# EAGLE design SevenSegmentDriver (EAGLE 7.5.0)
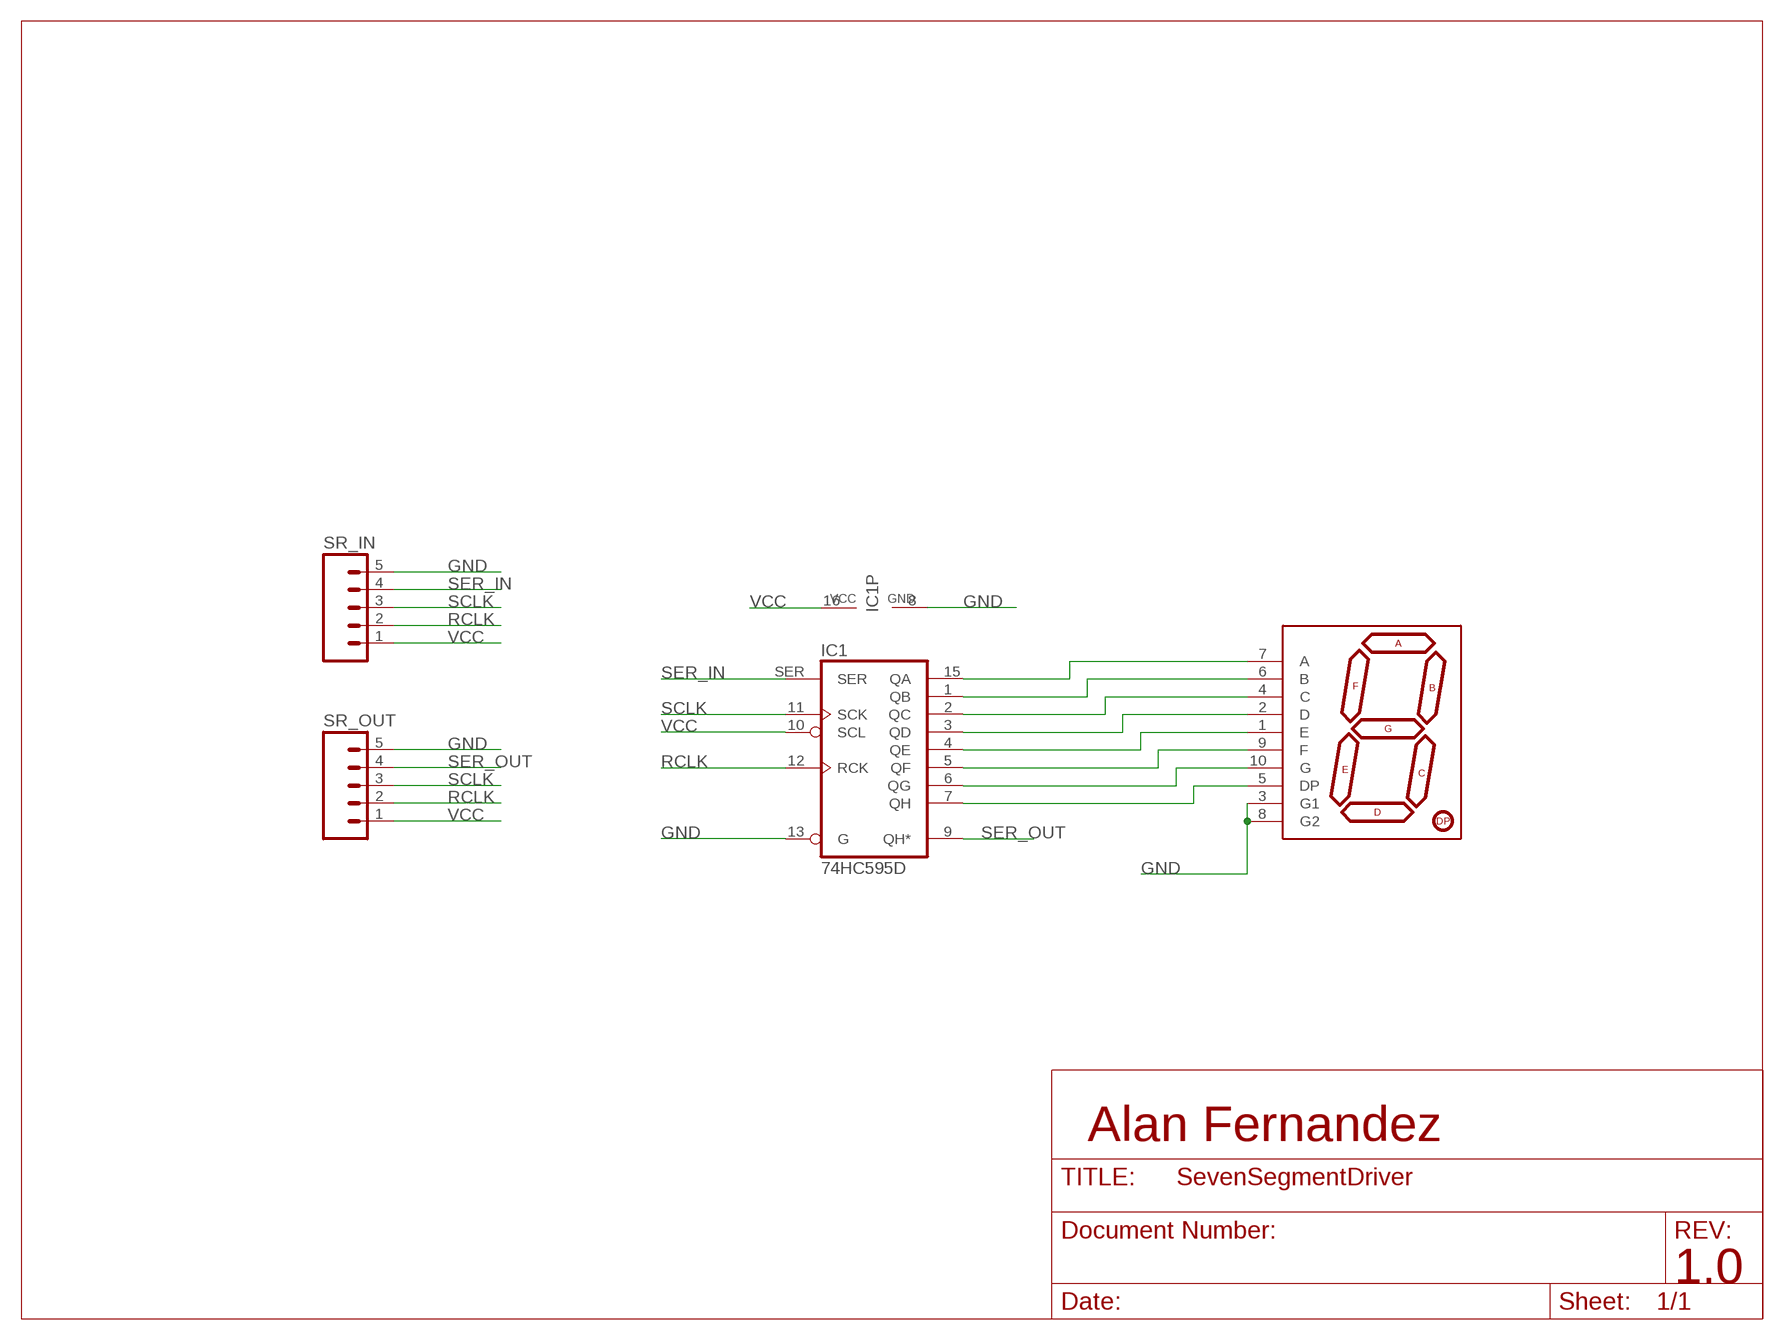
[diagram p0: schematic, sheet 1]

## Parts
IC1  74HC595D  [SO16]
SR_IN  M05PTH  [1X05]
SR_OUT  M05PTH  [1X05]
U$1  7-SEGMENT-DISPLAY-1"-REDEZ  [7-SEGMENT-1"PTH-EZ]

## Nets
GND: IC1.8(GND) IC1.13(G) SR_IN.5 SR_OUT.5 U$1.3(G1) U$1.8(G2)
N$3: IC1.15(QA) U$1.7(A)
N$4: IC1.1(QB) U$1.6(B)
N$5: IC1.2(QC) U$1.4(C)
N$6: IC1.3(QD) U$1.2(D)
N$7: IC1.4(QE) U$1.1(E)
N$8: IC1.5(QF) U$1.9(F)
N$9: IC1.6(QG) U$1.10(G)
N$10: IC1.7(QH) U$1.5(DP)
RCLK: IC1.12(RCK) SR_IN.2 SR_OUT.2
SCLK: IC1.11(SCK) SR_IN.3 SR_OUT.3
SER_IN: IC1.SER SR_IN.4
SER_OUT: IC1.9(QH*) SR_OUT.4
VCC: IC1.10(SCL) IC1.16(VCC) SR_IN.1 SR_OUT.1

## Notes on the sheet
- Alan Fernandez
- 1.0

## Library data of the parts
IC1 = 74xx-eu:74*595: 8-bit SHIFT REGISTER, output latch
SR_IN SR_OUT = SparkFun-Connectors:M05: Header 5 Standard 5-pin 0.1" header. Use with straight break away headers (SKU : PRT-00116), right angle break away headers (PRT-00553), swiss pins (PRT-00743), machine pins (PRT-00117), and female headers (PRT-00115). Molex polarized connector foot print use with SKU : PRT-08230 with associated crimp pins and housings.
U$1 = SparkFun-Displays:7-SEGMENT-DISPLAY-1"-RED: 7-Segment Display 1" Red (COM-08546) EZ is for kits. Pads are only exposed on the bottom side to help prevent soldering in upside down.

## Net classes
0 default: width 0.406 mm, drill 0.381 mm, clearance 0.305 mm

## Board
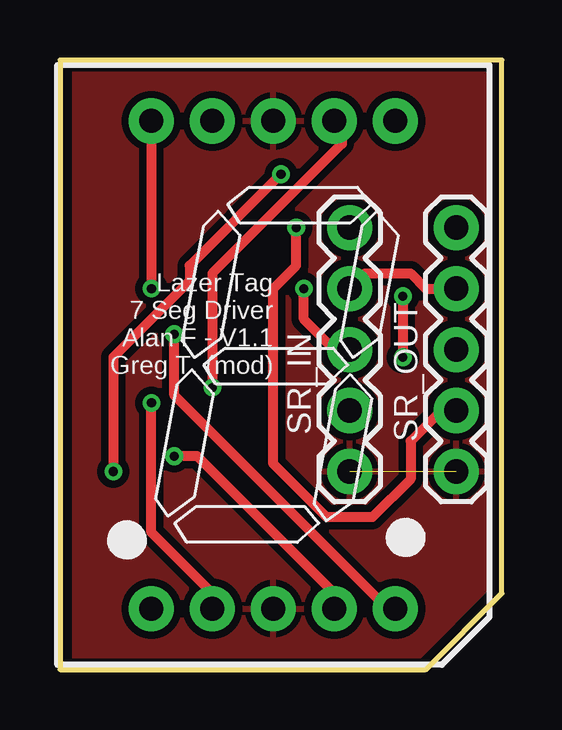
[diagram p1: board, top side]
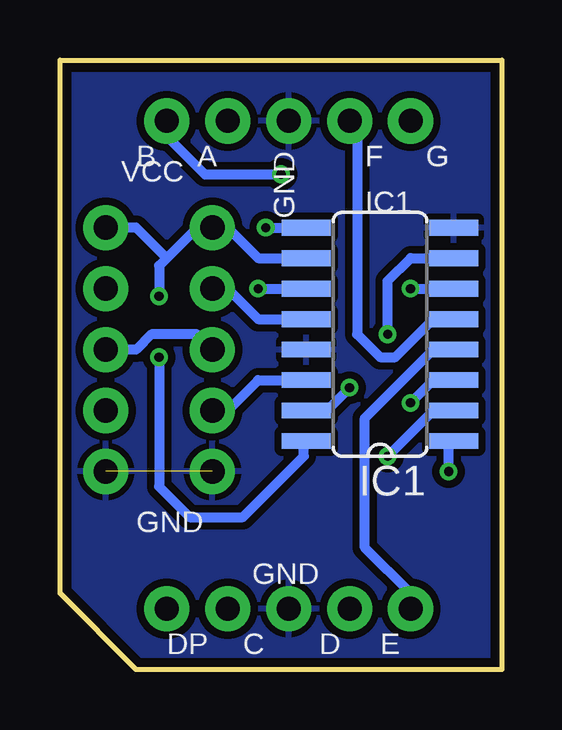
[diagram p2: board, bottom side, seen from below]

Size 18.41 x 25.4 mm. Coordinates in mm from the lower left corner, seen from the top.
Outline: 0,25.4 0,0 15.24,0 18.41,3.18 18.41,25.4 0,25.4
Copper layers (1*16): Top 0.0356mm / dielectric 1.5011mm / Bottom 0.0356mm
Design rules "oshpark-2layer": minimum track width 6mil, minimum drill 13mil, track to track 6mil, track to pad 6mil, pad to pad 6mil, via to via 6mil, smd to smd 6mil, copper to edge 15mil, drill to drill 6mil, minimum pad ring 7mil, minimum via ring 7mil, stop-mask expansion 2.5mil, vias tented up to drill 0mil, thermal gap 10mil

### Footprints (pad centres in the part's own frame; a part is rotated, then mirrored left to right if it is on the bottom)
SO16 = smd 0.66 x 2.032: 1 -4.445,-3.073; 2 -3.175,-3.073; 3 -1.905,-3.073; 4 -0.635,-3.073; 5 0.635,-3.073; 6 1.905,-3.073; 7 3.175,-3.073; 8 4.445,-3.073; 9 4.445,3.073; 10 3.175,3.073; 11 1.905,3.073; 12 0.635,3.073; 13 -0.635,3.073; 15 -3.175,3.073; 16 -4.445,3.073; SER -1.905,3.073
1X05 = drill 1.016 pad 1.88: 1 0,0; 2 2.54,0; 3 5.08,0; 4 7.62,0; 5 10.16,0
7-SEGMENT-1"PTH-EZ = drill 1 pad 1.88: 1 -5.08,-10.16; 2 -2.54,-10.16; 3 0,-10.16; 4 2.54,-10.16; 5 5.08,-10.16; 6 5.08,10.16; 7 2.54,10.16; 8 0,10.16; 9 -2.54,10.16; 10 -5.08,10.16

### Placement (x,y rotation side)
IC1  5.08,13.97 90 bottom
SR_IN  12.07,18.42 270 top
SR_OUT  16.51,18.42 270 top
U$1  8.89,12.7 0 top

### Tracks (layer width: path | path; a pad name or v marks a point on that pad's centre or on a via)
GND  (1 unrouted)
  pour Bottom: 0,25.4 0,0 15.24,0 18.41,3.18 18.41,25.4
  pour Top: 0,25.4 0,0 15.24,0 18.41,3.18 18.41,25.4
N$3  (via drill 0.38)
  Top 0.406: v6.35,11.75 6.35,16.51 11.75,21.91 11.75,22.54 U$1.7
  Bottom 0.406: IC1.15 7.3,10.79 v6.35,11.75
N$4  (via drill 0.38)
  Top 0.406: v2.22,8.25 2.22,13.02 5.4,16.19 5.4,16.83 v9.21,20.64
  Bottom 0.406: v2.22,8.25 2.22,9.52 IC1.1 | v9.21,20.64 12.38,20.64 13.97,22.22 U$1.6
N$5  (via drill 0.38)
  Top 0.406: v4.76,8.89 5.72,8.89 11.43,3.18 U$1.4
  Bottom 0.406: IC1.2 2.86,10.79 v4.76,8.89
N$6  (via drill 0.38)
  Top 0.406: v3.81,11.11 3.81,5.71 6.35,3.18 U$1.2
  Bottom 0.406: IC1.3 2.86,12.06 v3.81,11.11
N$7
  Bottom 0.406: IC1.4 2.86,13.33 5.72,10.48 5.72,5.08 3.81,3.18 U$1.1
N$8
  Bottom 0.406: IC1.5 2.86,14.61 4.45,13.02 5.08,13.02 6.03,13.97 6.03,22.54 U$1.9
N$9  (via drill 0.38)
  Top 0.406: U$1.10 v3.81,15.87
  Bottom 0.406: v3.81,15.87 IC1.6
N$10  (via drill 0.38)
  Top 0.406: v4.76,13.97 4.76,11.43 13.65,2.54 U$1.5
  Bottom 0.406: IC1.7 3.81,17.14 4.76,16.19 v4.76,13.97
RCLK
  Top 0.406: SR_OUT.2 15.24,15.87 14.61,16.51 12.7,16.51 SR_IN.2
  Bottom 0.406: IC1.12 10.16,14.61 11.43,15.87 SR_IN.2
SCLK  (via drill 0.38)
  Top 0.406: v10.16,15.87 10.16,14.61 11.43,13.33 SR_IN.3
  Bottom 0.406: v10.16,15.87 IC1.11 | SR_OUT.3 15.24,13.33 14.61,13.97 12.7,13.97 SR_IN.3
SER_IN
  Bottom 0.406: IC1.SER 10.16,12.06 11.43,10.79 SR_IN.4
SER_OUT  (via drill 0.38)
  Top 0.406: v9.84,18.42 9.84,16.83 8.89,15.87 8.89,8.57 11.11,6.35 13.02,6.35 14.61,7.94 14.61,9.52 15.88,10.79 SR_OUT.4
  Bottom 0.406: v9.84,18.42 IC1.9
VCC  (via drill 0.38)
  Top 0.406: v14.29,15.56 v14.29,13.02
  Bottom 0.406: v14.29,13.02 14.29,7.62 13.02,6.35 10.8,6.35 8.26,8.89 8.26,9.52 IC1.16 | v14.29,15.56 14.29,16.83 13.97,17.14 | 13.97,17.14 12.7,18.42 SR_IN.1 11.43,18.42 10.16,17.14 IC1.10 | SR_OUT.1 15.24,18.42 13.97,17.14

### Text on the board
tPlace: Lazer Tag / 7 Seg Driver / Alan F - V1.1 / Greg T. (mod)
bPlace: GND | G | F | A | B | VCC | IC1 | GND | GND | E | D | C | DP